# EAGLE schematic teensy_canbus_IMU_servo (EAGLE 9.6.2)
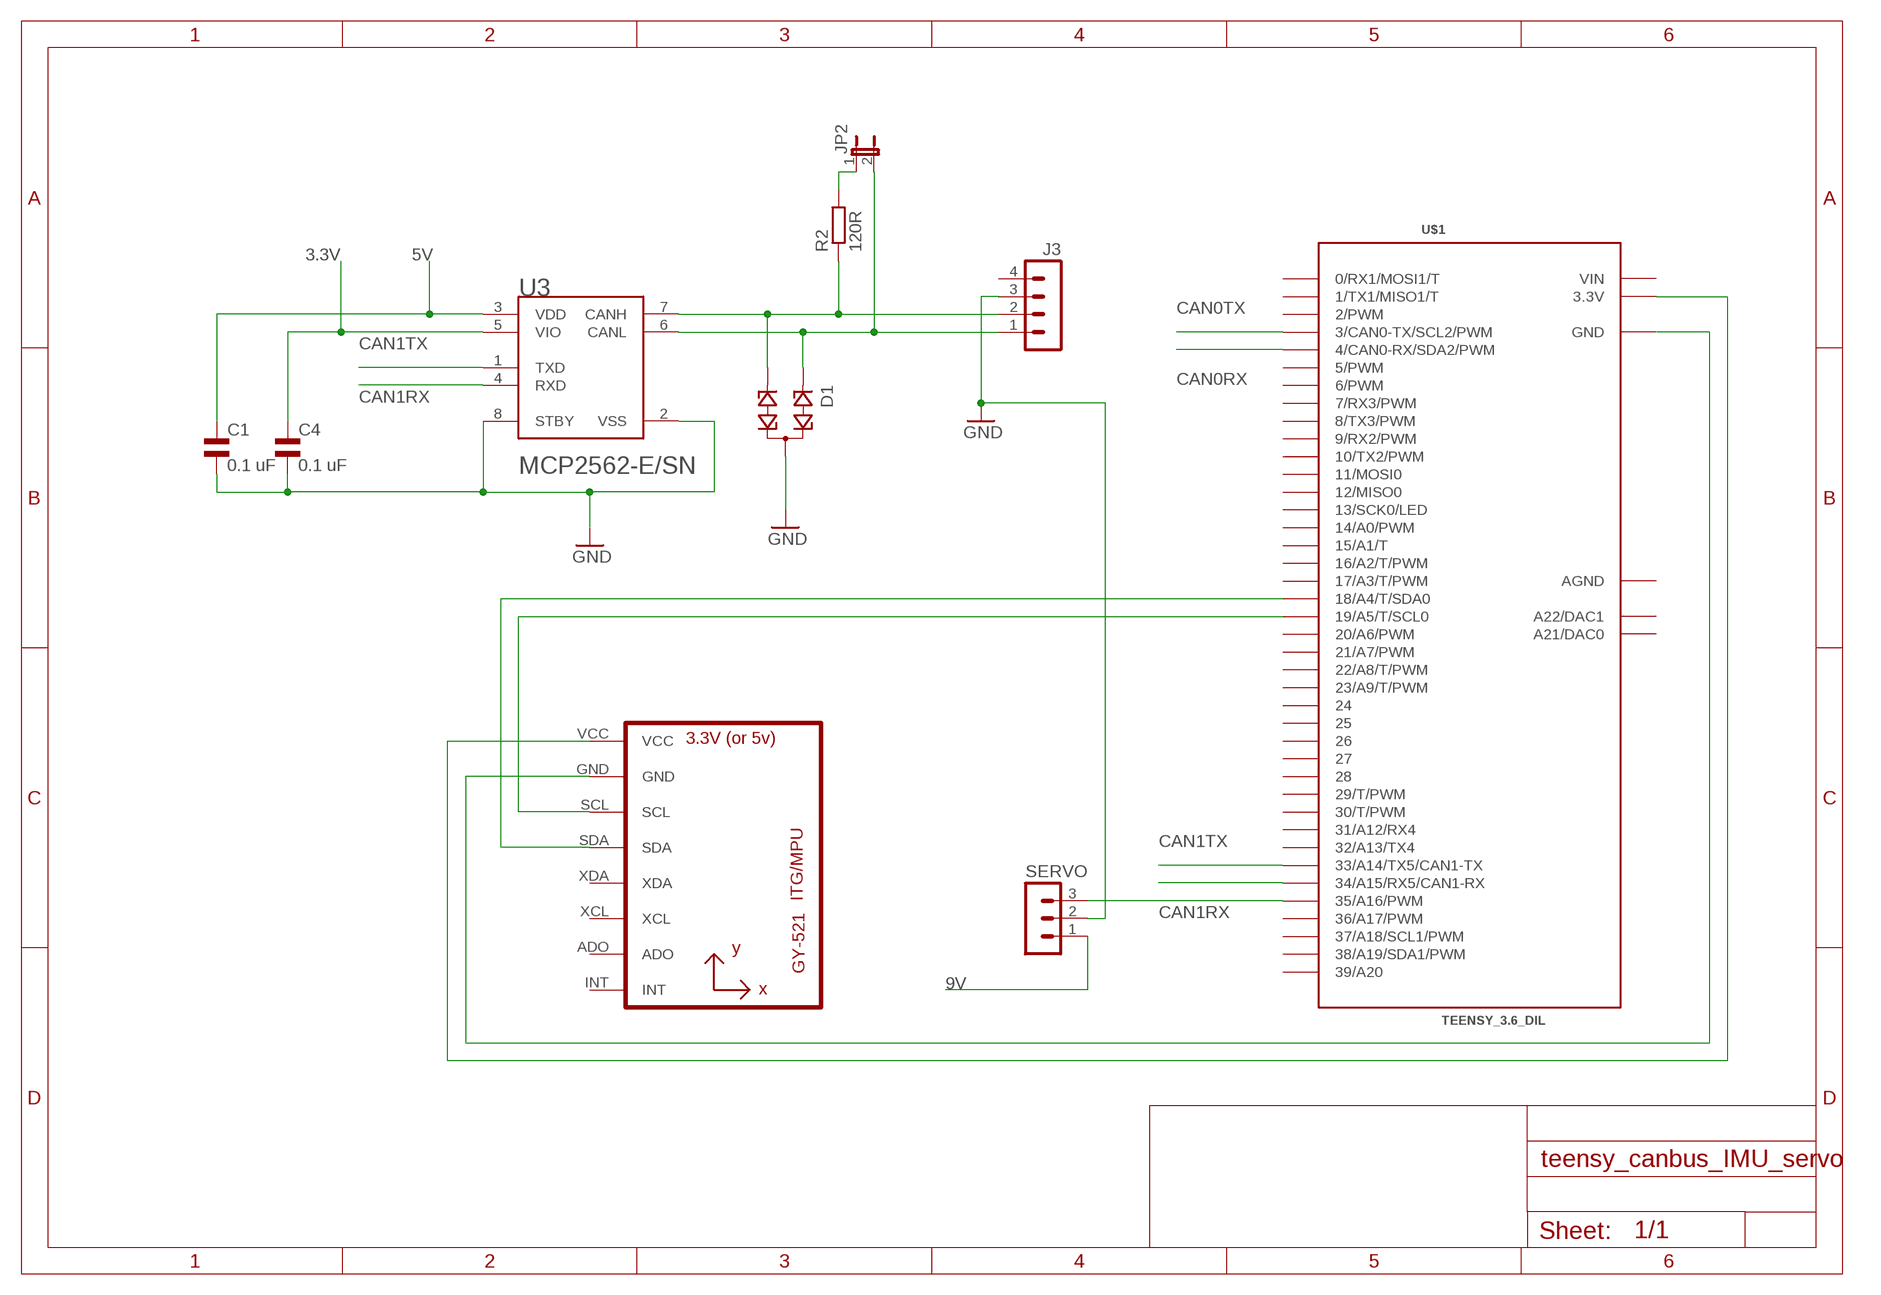
[diagram p0: schematic, sheet 1]

## Parts
C1  0.1 uF  EL-BI25-10AXIAL  [EU25-10]
C4  0.1 uF  EL-BI25-10AXIAL  [EU25-10]
D1  PESD1CAN  [SOT23]
J3  MA04-1  [MA04-1]
JP2  JP1E  [JP1]
R2  120R  R-EU_0204/2V  [0204V]
SERVO  MA03-1  [MA03-1]
U1  GY-521MPU6050  [GY-521]
U3  MICROCHIP_MCP2562-E-SNMICROCHIP_MCP2562-E-SN_0_0  [MICROCHIP_MCP2562-E-SN_0]
U$1  TEENSY_3.6_DIL  [TEENSY_3.6_DIL]

## Nets
3.3V: C4.1 U3.5(VIO)
5V: C1.1 U3.3(VDD)
9V: SERVO.1
CAN0RX: U$1.4(4/CAN0-RX/SDA2/PWM)
CAN0TX: U$1.3(3/CAN0-TX/SCL2/PWM)
CAN1RX: U3.4(RXD) U$1.34/A15(34/A15/RX5/CAN1-RX)
CAN1TX: U3.1(TXD) U$1.33/A14(33/A14/TX5/CAN1-TX)
GND: C1.2 C4.2 D1.3 J3.3 SERVO.2 U3.2(VSS) U3.8(STBY)
N$1: D1.2 J3.2 R2.1 U3.7(CANH)
N$2: D1.1 J3.1 JP2.2 U3.6(CANL)
N$3: JP2.1 R2.2
N$4: SERVO.3 U$1.35/A16(35/A16/PWM)
N$5: U1.VCC U$1.3.3V U$1.3.3V3(3.3V)
N$6: U1.GND U$1.GND U$1.GND1(GND)
N$7: U1.SCL U$1.19/A5(19/A5/T/SCL0)
N$8: U1.SDA U$1.18/A4(18/A4/T/SDA0)
Unconnected: J3.4 U1.ADO U1.INT U1.XCL U1.XDA U$1.0(0/RX1/MOSI1/T) U$1.1(1/TX1/MISO1/T) U$1.2(2/PWM) U$1.5(5/PWM) U$1.6(6/PWM) U$1.7(7/RX3/PWM) U$1.8(8/TX3/PWM) U$1.9(9/RX2/PWM) U$1.10(10/TX2/PWM) U$1.11(11/MOSI0) U$1.12(12/MISO0) U$1.13(13/SCK0/LED) U$1.14/A0(14/A0/PWM) U$1.15/A1(15/A1/T) U$1.16/A2(16/A2/T/PWM) U$1.17/A3(17/A3/T/PWM) U$1.20/A6(20/A6/PWM) U$1.21/A7(21/A7/PWM) U$1.22/A8(22/A8/T/PWM) U$1.23/A9(23/A9/T/PWM) U$1.24 U$1.25 U$1.26 U$1.27 U$1.28 U$1.29(29/T/PWM) U$1.30(30/T/PWM) U$1.31/A12(31/A12/RX4) U$1.32/A13(32/A13/TX4) U$1.36/A17(36/A17/PWM) U$1.37/A18(37/A18/SCL1/PWM) U$1.38/A19(38/A19/SDA1/PWM) U$1.39/A20 U$1.A21(A21/DAC0) U$1.A22(A22/DAC1)

## Power pins joined to a net without a drawn wire
AGND: U$1.AGND
VIN: U$1.VIN

## Library data of the parts
C1 C4 = rcl:EL-: BIPOLAR ELECTROLYTIC CAPACITOR; SPICEPREFIX: C
D1 = diode:PESD1CAN: CAN bus ESD protection diode Source: http://www.nxp.com/documents/data_sheet/PESD1CAN.pdf
J3 = con-lstb:MA04-1: PIN HEADER; OC_FARNELL: unknown; OC_NEWARK: unknown
JP2 = jumper:JP1E: JUMPER
R2 = rcl:R-EU_: RESISTOR, European symbol; SPICEPREFIX: R
SERVO = con-lstb:MA03-1: PIN HEADER; OC_FARNELL: unknown; OC_NEWARK: unknown
U1 = gy-521:GY-521
U3 = SN:MICROCHIP_MCP2562-E-SN: High-Speed CAN Transceiver; CENTROID_NOT_SPECIFIED: No; DATASHEET: http://ww1.microchip.com/downloads/en/DeviceDoc/20005167C.pdf; DIGIKEY_DESCRIPTION: IC 1/1 Transceiver Full CAN 8-SOIC; DIGIKEY_PART_NUMBER: MCP2562-E/SN-ND; DUPLEX: Full; LEAD_FREE: yes; MF: Microchip; MFG_PACKAGE_IDENT: SN; MOUSER_PART_NUMBER: 579-MCP2562-E/SN; MPN: MCP2562-E/SN; NUMBER_OF_DRIVERS/RECEIVERS: 1/1; PACKAGE: SOIC8; PREFIX: U; ROHS: yes; TEMPERATURE_RANGE_HIGH: +125°C; TEMPERATURE_RANGE_LOW: -40°C; VOLTAGE_-_SUPPLY: 4.5V ~ 5.5V
U$1 = Teensy_3_and_LC_Series_Boards_v1.4:TEENSY_3.6_DIL: Teensy 3.6 DIL Package

## Module MPC
Ports: 

### Library data of the parts